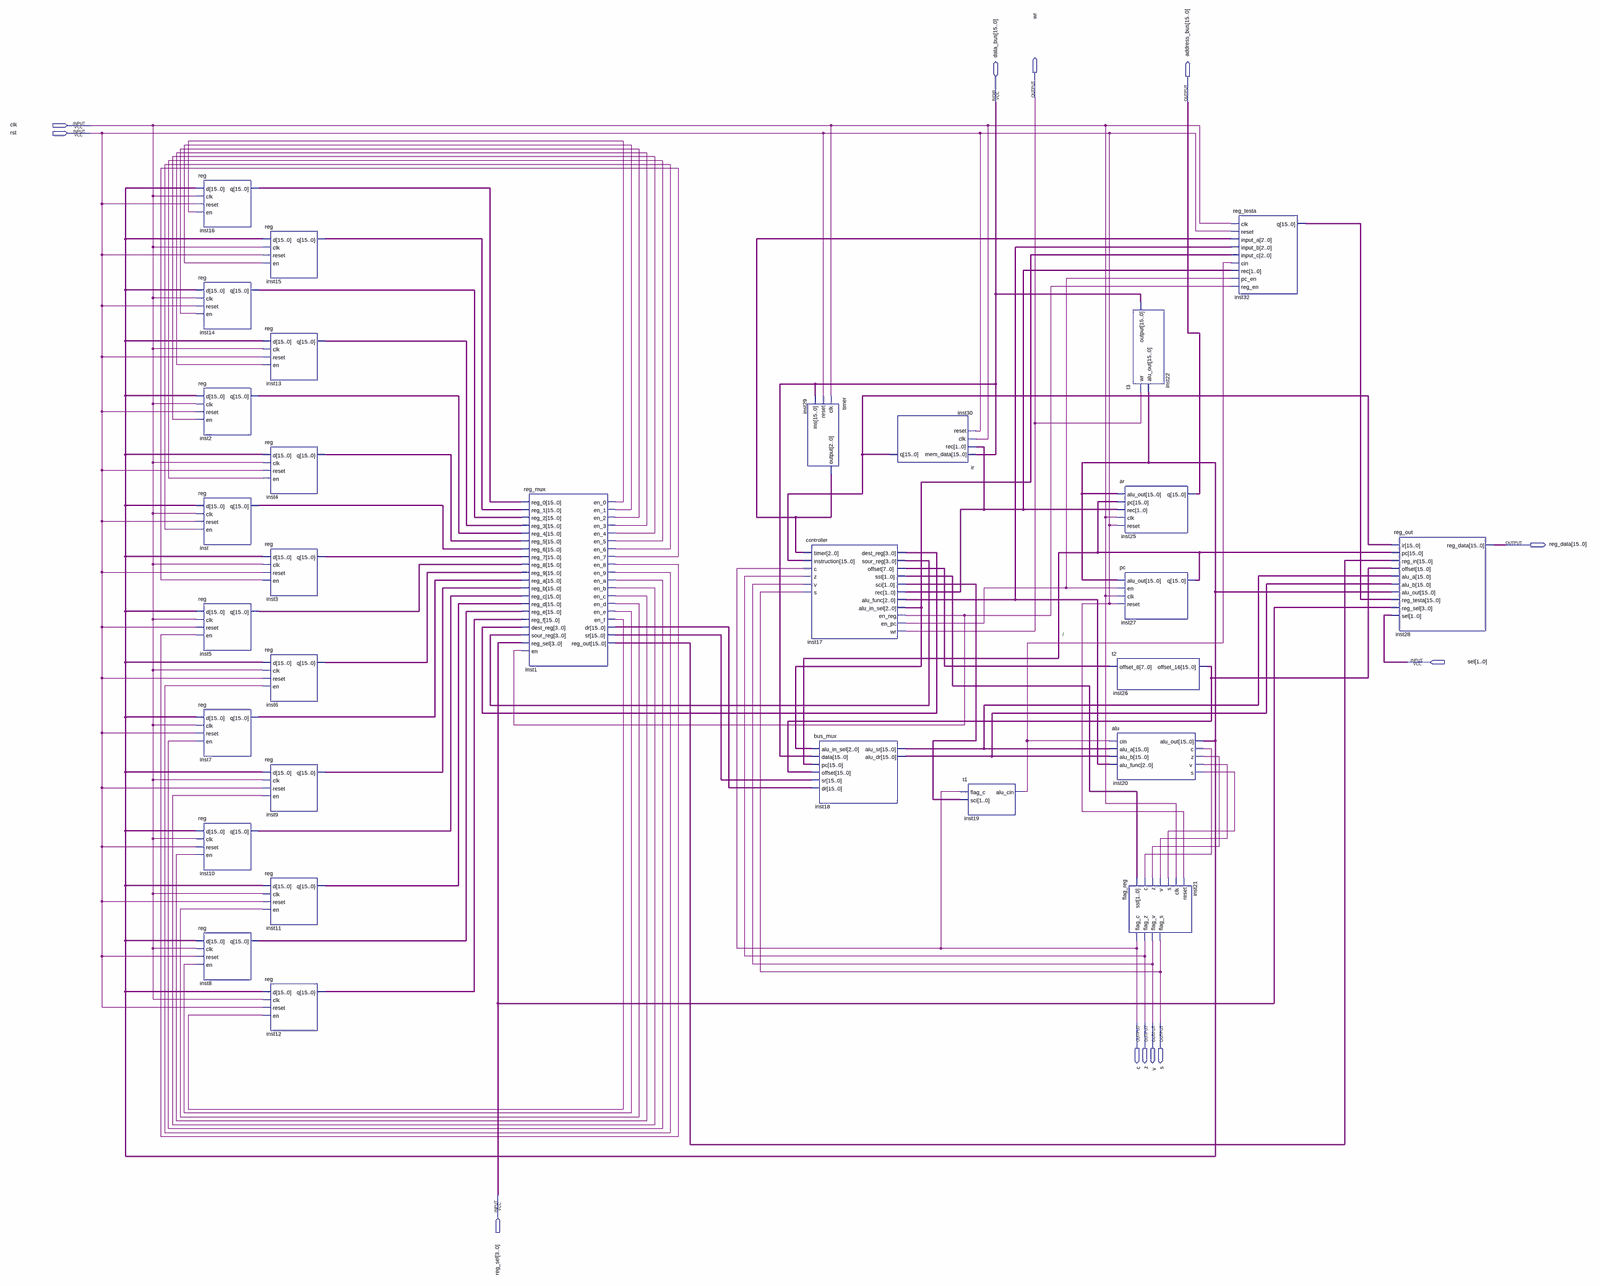
[diagram p0: schematic sheet, whole]
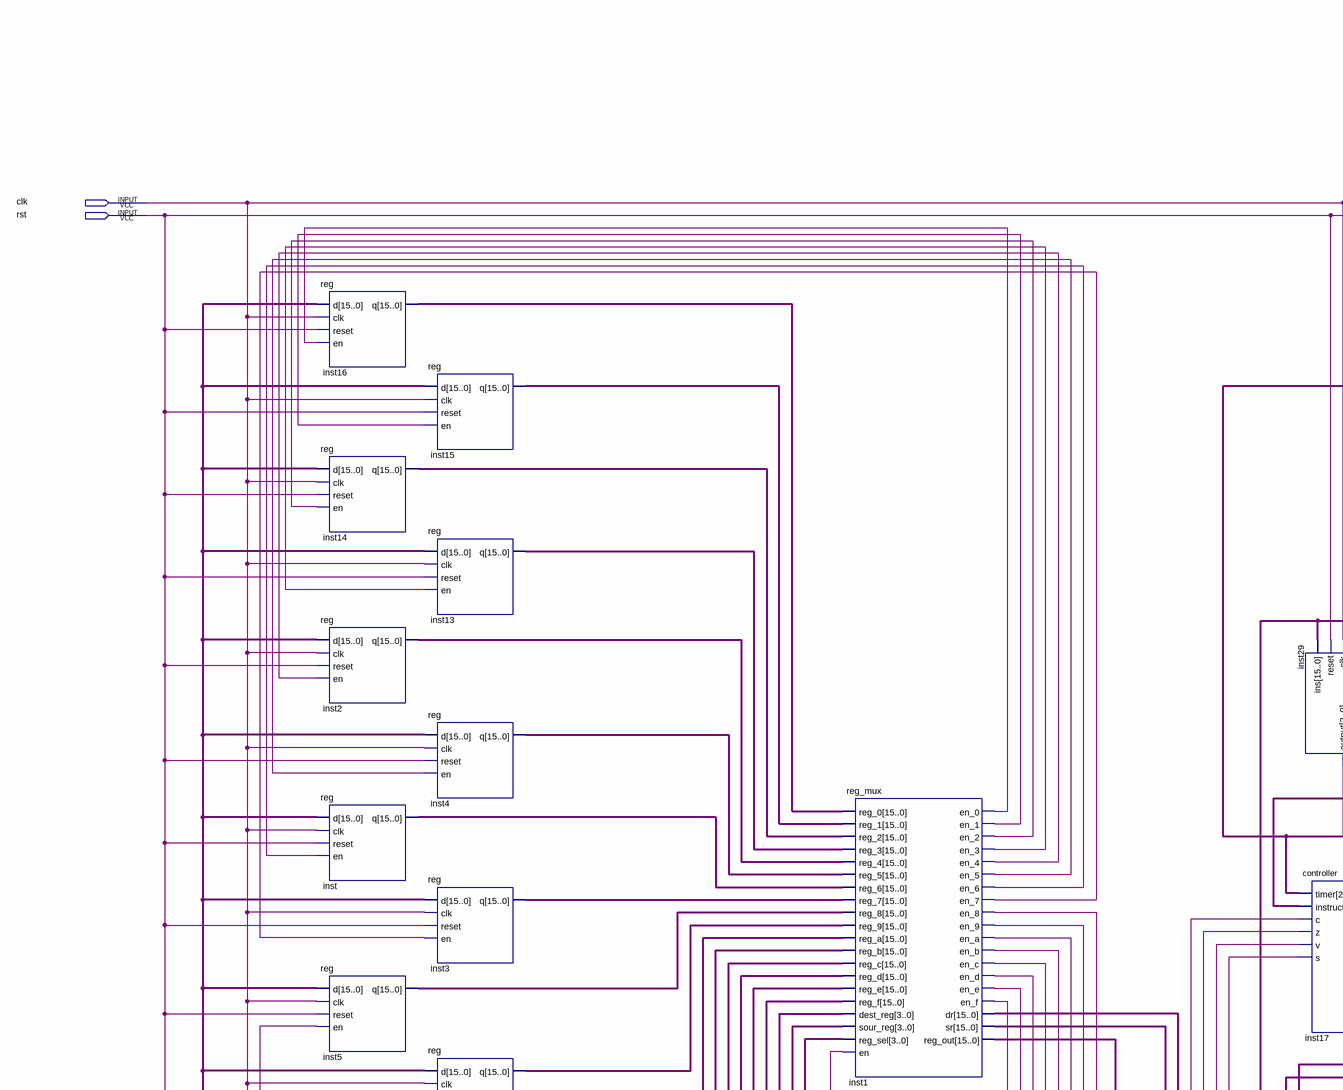
[diagram p1: schematic sheet, upper left part]
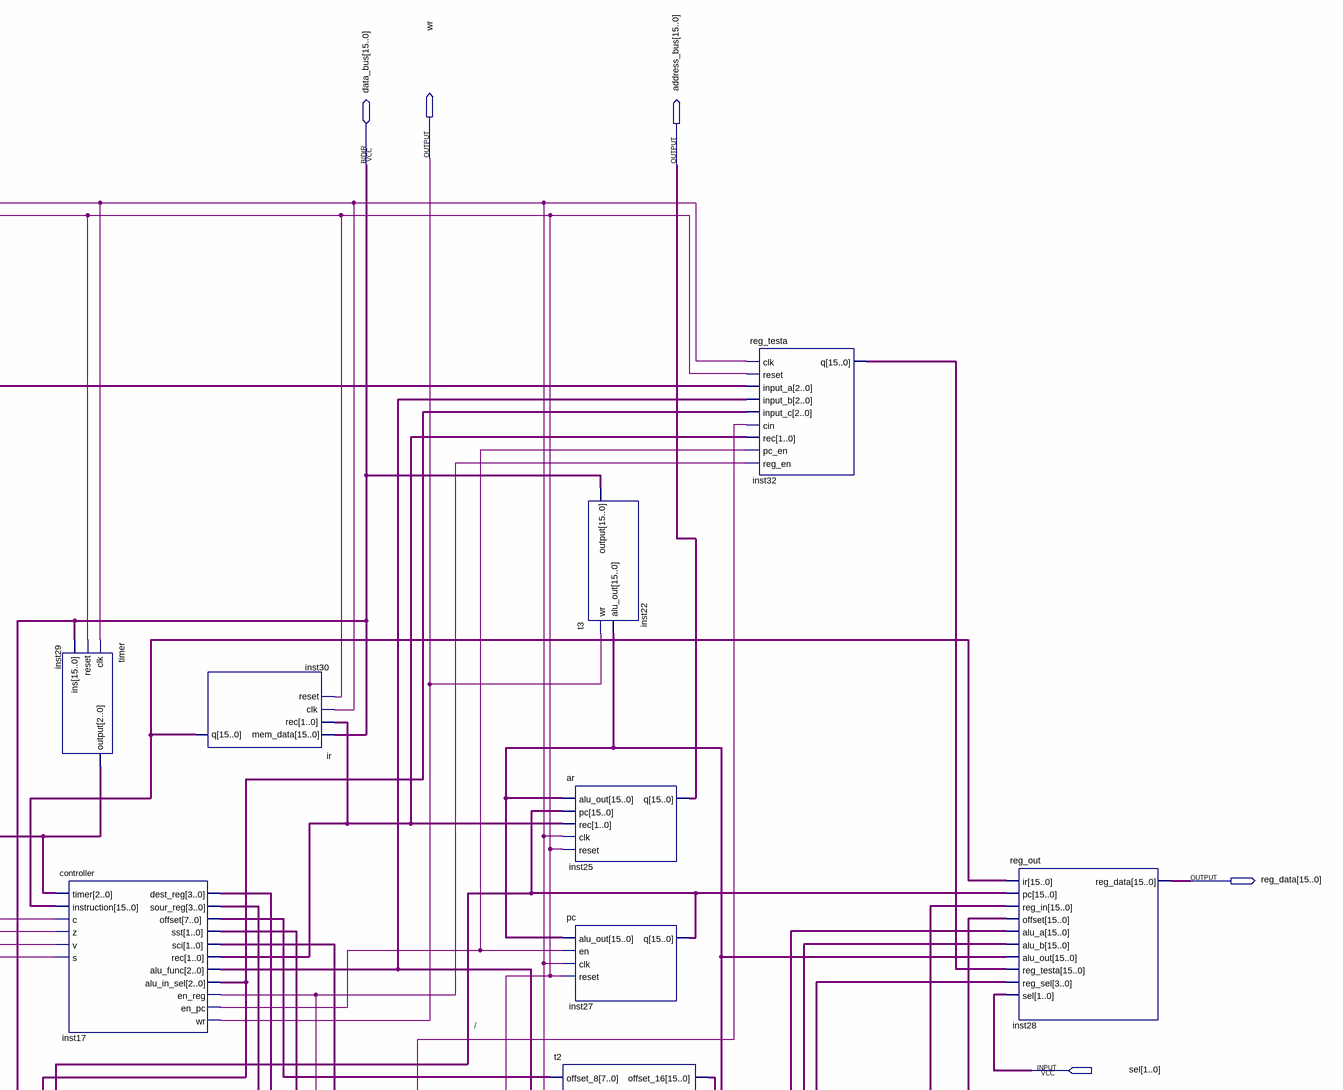
[diagram p2: schematic sheet, upper right part]
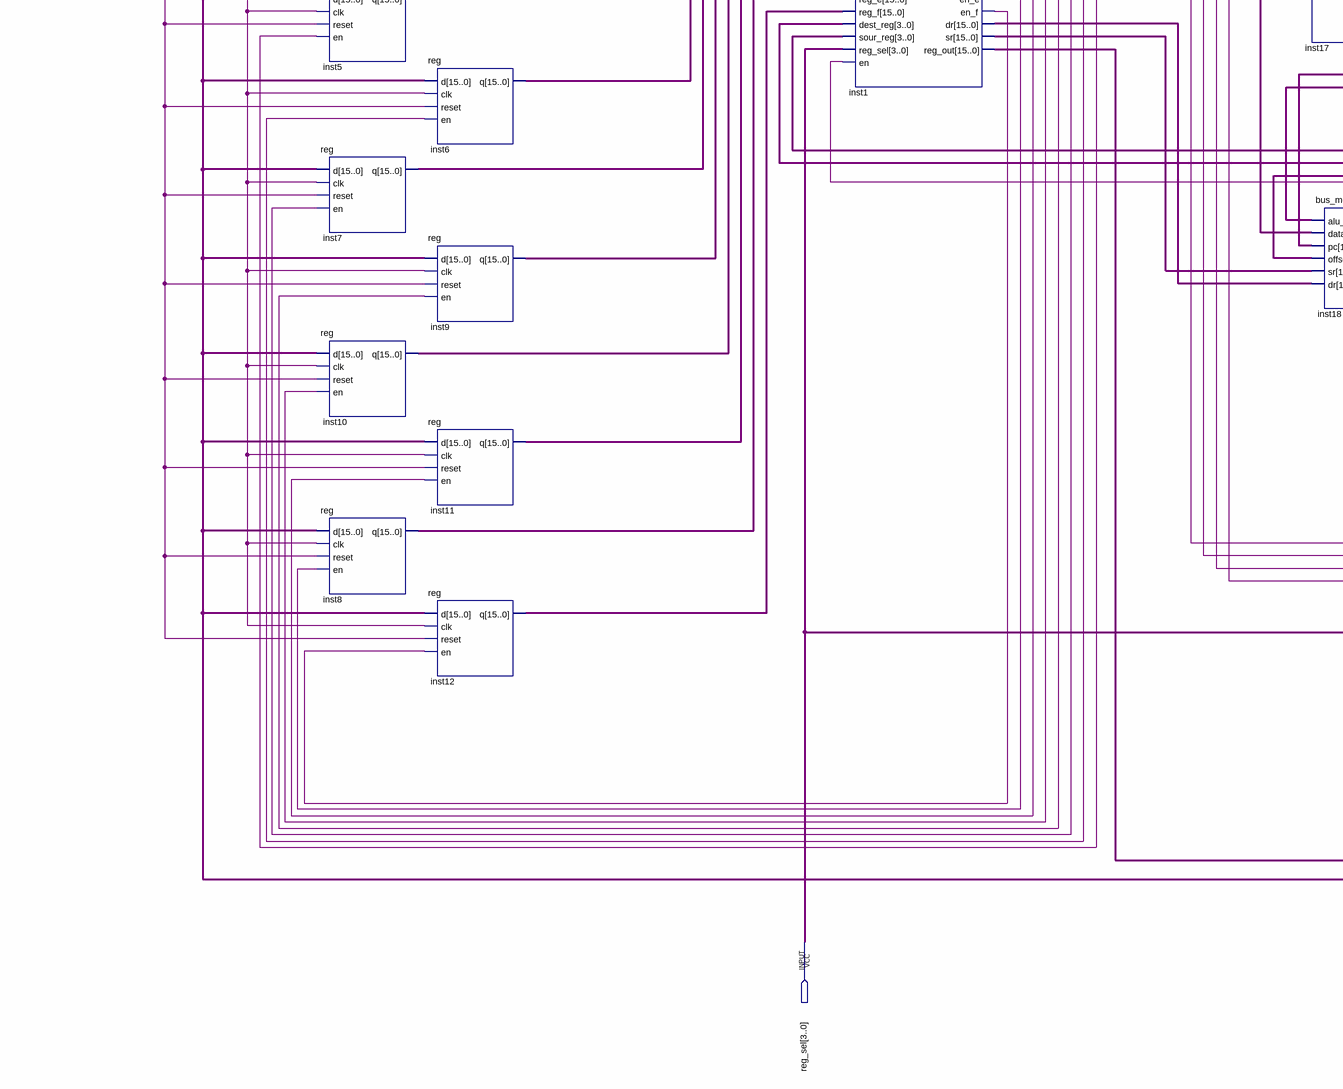
[diagram p3: schematic sheet, lower left part]
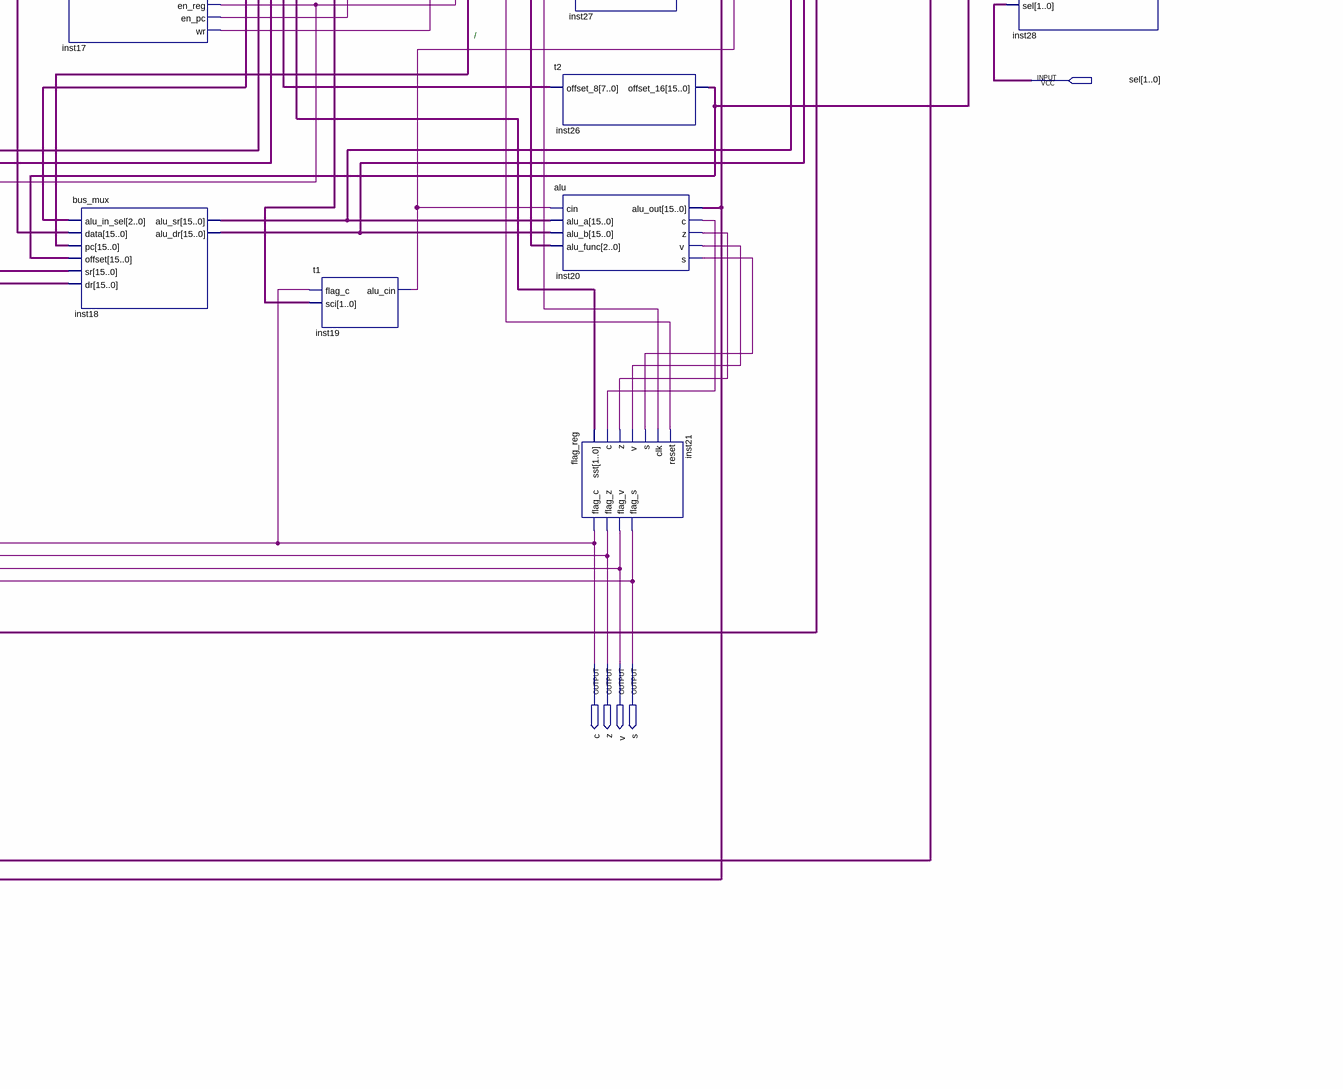
[diagram p4: schematic sheet, lower right part]
// Quartus schematic cpu.bdf as structural Verilog: 30 symbols, 12 pins
module cpu (
  input  clk,
  input  rst,
  input  [1:0] sel,
  input  [3:0] reg_sel,
  inout  [15:0] data_bus,
  output wr,
  output [15:0] address_bus,
  output [15:0] reg_data,
  output c,
  output z,
  output v,
  output s
);

  wire inst1_en_0, inst1_en_1, inst1_en_2, inst1_en_3, inst1_en_4, inst1_en_5, inst1_en_6, inst1_en_7,
       inst1_en_8, inst1_en_9, inst1_en_a, inst1_en_b, inst1_en_c, inst1_en_d, inst1_en_e, inst1_en_f,
       inst17_en_pc, inst17_en_reg, inst19_alu_cin, inst20_c, inst20_s, inst20_v, inst20_z;
  wire [1:0] inst17_rec, inst17_sci, inst17_sst;
  wire [2:0] inst17_alu_func, inst17_alu_in_sel, inst29_output;
  wire [3:0] inst17_dest_reg, inst17_sour_reg;
  wire [7:0] inst17_offset;
  wire [15:0] inst1_dr, inst1_reg_out, inst1_sr, inst2_q, inst3_q, inst4_q, inst5_q, inst6_q, inst7_q,
       inst8_q, inst9_q, inst10_q, inst11_q, inst12_q, inst13_q, inst14_q, inst15_q, inst16_q, inst18_alu_dr,
       inst18_alu_sr, inst20_alu_out, inst26_offset_16, inst27_q, inst30_q, inst32_q, inst_q;

  \reg  inst16 (.d(inst20_alu_out), .clk(clk), .reset(rst), .en(inst1_en_0), .q(inst16_q));
  \reg  inst14 (.d(inst20_alu_out), .clk(clk), .reset(rst), .en(inst1_en_2), .q(inst14_q));
  \reg  inst2 (.d(inst20_alu_out), .clk(clk), .reset(rst), .en(inst1_en_4), .q(inst2_q));
  \reg  inst (.d(inst20_alu_out), .clk(clk), .reset(rst), .en(inst1_en_6), .q(inst_q));
  \reg  inst5 (.d(inst20_alu_out), .clk(clk), .reset(rst), .en(inst1_en_8), .q(inst5_q));
  \reg  inst7 (.d(inst20_alu_out), .clk(clk), .reset(rst), .en(inst1_en_a), .q(inst7_q));
  \reg  inst10 (.d(inst20_alu_out), .clk(clk), .reset(rst), .en(inst1_en_c), .q(inst10_q));
  \reg  inst8 (.d(inst20_alu_out), .clk(clk), .reset(rst), .en(inst1_en_e), .q(inst8_q));
  \reg  inst15 (.d(inst20_alu_out), .clk(clk), .reset(rst), .en(inst1_en_1), .q(inst15_q));
  \reg  inst13 (.d(inst20_alu_out), .clk(clk), .reset(rst), .en(inst1_en_3), .q(inst13_q));
  \reg  inst4 (.d(inst20_alu_out), .clk(clk), .reset(rst), .en(inst1_en_5), .q(inst4_q));
  \reg  inst3 (.d(inst20_alu_out), .clk(clk), .reset(rst), .en(inst1_en_7), .q(inst3_q));
  \reg  inst6 (.d(inst20_alu_out), .clk(clk), .reset(rst), .en(inst1_en_9), .q(inst6_q));
  \reg  inst9 (.d(inst20_alu_out), .clk(clk), .reset(rst), .en(inst1_en_b), .q(inst9_q));
  \reg  inst11 (.d(inst20_alu_out), .clk(clk), .reset(rst), .en(inst1_en_d), .q(inst11_q));
  \reg  inst12 (.d(inst20_alu_out), .clk(clk), .reset(rst), .en(inst1_en_f), .q(inst12_q));
  reg_mux inst1 (
    .reg_0(inst16_q), .reg_1(inst15_q), .reg_2(inst14_q), .reg_3(inst13_q), .reg_4(inst2_q), .reg_5(inst4_q),
    .reg_6(inst_q), .reg_7(inst3_q), .reg_8(inst5_q), .reg_9(inst6_q), .reg_a(inst7_q), .reg_b(inst9_q),
    .reg_c(inst10_q), .reg_d(inst11_q), .reg_e(inst8_q), .reg_f(inst12_q), .dest_reg(inst17_dest_reg),
    .sour_reg(inst17_sour_reg), .reg_sel(reg_sel), .en(inst17_en_reg), .en_0(inst1_en_0), .en_1(inst1_en_1),
    .en_2(inst1_en_2), .en_3(inst1_en_3), .en_4(inst1_en_4), .en_5(inst1_en_5), .en_6(inst1_en_6),
    .en_7(inst1_en_7), .en_8(inst1_en_8), .en_9(inst1_en_9), .en_a(inst1_en_a), .en_b(inst1_en_b),
    .en_c(inst1_en_c), .en_d(inst1_en_d), .en_e(inst1_en_e), .en_f(inst1_en_f), .dr(inst1_dr), .sr(inst1_sr),
    .reg_out(inst1_reg_out));
  timer inst29 (.clk(clk), .reset(rst), .ins(data_bus), .\output (inst29_output));
  controller inst17 (
    .timer(inst29_output), .instruction(inst30_q), .c(c), .z(z), .v(v), .s(s), .dest_reg(inst17_dest_reg),
    .sour_reg(inst17_sour_reg), .offset(inst17_offset), .sst(inst17_sst), .sci(inst17_sci), .rec(inst17_rec),
    .alu_func(inst17_alu_func), .alu_in_sel(inst17_alu_in_sel), .en_reg(inst17_en_reg), .en_pc(inst17_en_pc),
    .wr(wr));
  bus_mux inst18 (
    .alu_in_sel(inst17_alu_in_sel), .data(data_bus), .pc(inst27_q), .offset(inst26_offset_16), .sr(inst1_sr),
    .dr(inst1_dr), .alu_sr(inst18_alu_sr), .alu_dr(inst18_alu_dr));
  ir inst30 (.mem_data(data_bus), .rec(inst17_rec), .clk(clk), .reset(rst), .q(inst30_q));
  t1 inst19 (.flag_c(c), .sci(inst17_sci), .alu_cin(inst19_alu_cin));
  t3 inst22 (.wr(wr), .alu_out(inst20_alu_out), .\output (data_bus));
  ar inst25 (.alu_out(inst20_alu_out), .pc(inst27_q), .rec(inst17_rec), .clk(clk), .reset(rst), .q(address_bus));
  pc inst27 (.alu_out(inst20_alu_out), .en(inst17_en_pc), .clk(clk), .reset(rst), .q(inst27_q));
  t2 inst26 (.offset_8(inst17_offset), .offset_16(inst26_offset_16));
  alu inst20 (
    .cin(inst19_alu_cin), .alu_a(inst18_alu_sr), .alu_b(inst18_alu_dr), .alu_func(inst17_alu_func),
    .alu_out(inst20_alu_out), .c(inst20_c), .z(inst20_z), .v(inst20_v), .s(inst20_s));
  flag_reg inst21 (
    .sst(inst17_sst), .c(inst20_c), .z(inst20_z), .v(inst20_v), .s(inst20_s), .clk(clk), .reset(rst),
    .flag_c(c), .flag_z(z), .flag_v(v), .flag_s(s));
  reg_testa inst32 (
    .clk(clk), .reset(rst), .input_a(inst29_output), .input_b(inst17_alu_func), .input_c(inst17_alu_in_sel),
    .cin(inst19_alu_cin), .rec(inst17_rec), .pc_en(inst17_en_pc), .reg_en(inst17_en_reg), .q(inst32_q));
  reg_out inst28 (
    .ir(inst30_q), .pc(inst27_q), .reg_in(inst1_reg_out), .offset(inst26_offset_16), .alu_a(inst18_alu_sr),
    .alu_b(inst18_alu_dr), .alu_out(inst20_alu_out), .reg_testa(inst32_q), .reg_sel(reg_sel), .sel(sel),
    .reg_data(reg_data));

  // Notes on the sheet:
  //   /
endmodule
